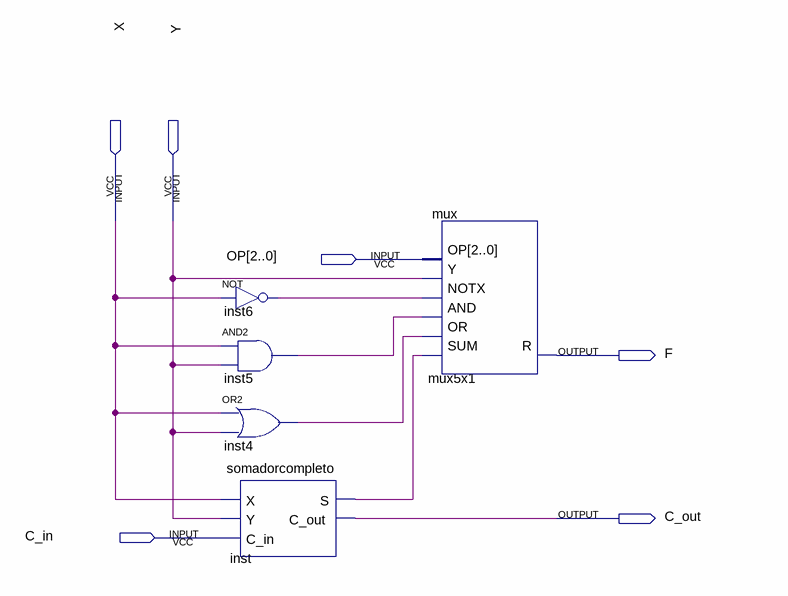
[diagram p0: schematic sheet]
// Quartus schematic ulaneander1bitFA.bdf as structural Verilog: 5 symbols, 6 pins
module ulaneander1bitFA (
  input  X,
  input  Y,
  input  [2:0] OP,
  input  C_in,
  output F,
  output C_out
);

  wire inst4_out, inst5_out, inst6_out, inst_s;

  not inst6 (inst6_out, X);
  and inst5 (inst5_out, X, Y);
  or inst4 (inst4_out, X, Y);
  somadorcompleto inst (.X(X), .Y(Y), .C_in(C_in), .S(inst_s), .C_out(C_out));
  mux5x1 mux (.SUM(inst_s), .OR(inst4_out), .AND(inst5_out), .NOTX(inst6_out), .Y(Y), .OP(OP), .R(F));
endmodule
